# Altium project 小四轴.PrjPCB
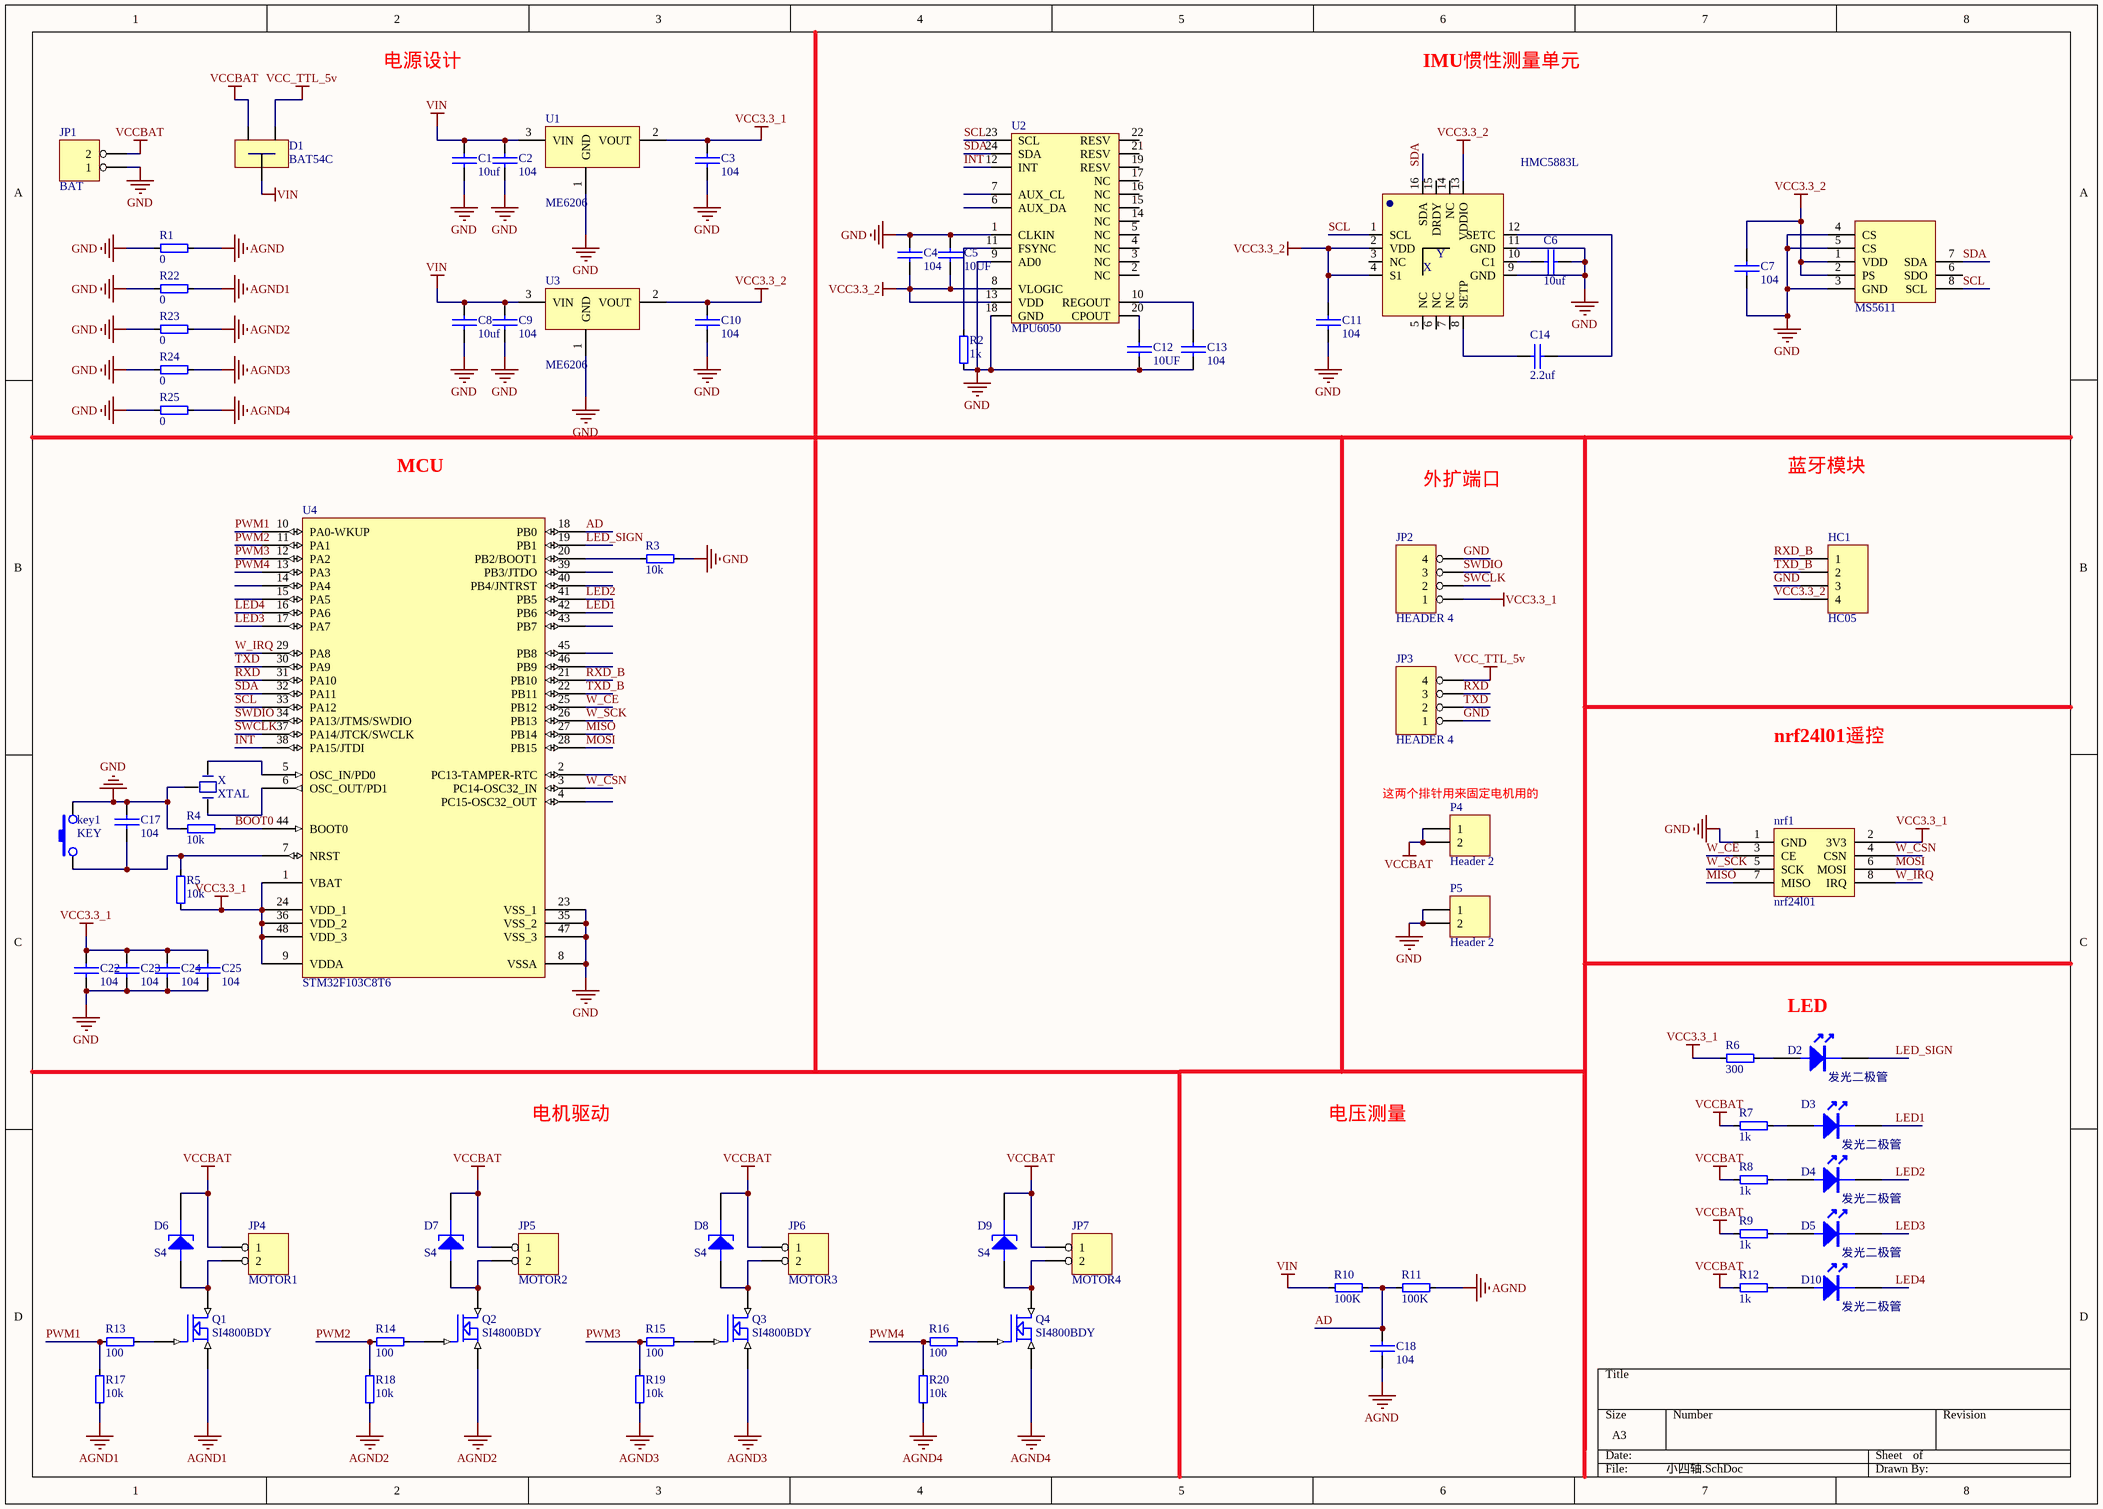
[diagram p0: 小四轴.SchDoc]
1 sheet, 77 parts. Net scope: global (net labels, ports and power ports of the same name join across sheets).
Board file: 小四轴.PcbDoc

## Sheet 小四轴.SchDoc
size A3

### Parts
*1  HMC5883L  [hmc5883l]
arctory1  MS5611  [MS5611]
C1  10uf  [0603P]
C2  104  [0603P]
C3  104  [0603P]
C4  104  [0603P]
C5  10UF  [0603P]
C6  10uf  [0603P]
C7  104  [0603p]
C8  10uf  [0603P]
C9  104  [0603P]
C10  104  [0603P]
C11  104  [0603P]
C12  10UF  [0603P]
C13  104  [0603P]
C14  2.2uf  [0603P]
C17  104  [0603P]
C18  104  [0603P]
C22  104  [0603P]
C23  104  [0603P]
C24  104  [0603P]
C25  104  [0603P]
D1  BAT54C  [SOT23]
D2  发光二极管  [0805]
D3  发光二极管  [0805]
D4  发光二极管  [0805]
D5  发光二极管  [0805]
D6  S4  [LC-SOD-123]
D7  S4  [LC-SOD-123]
D8  S4  [LC-SOD-123]
D9  S4  [LC-SOD-123]
D10  发光二极管  [0805]
HC1  HC05  [HDR1X4]
JP1  BAT  [HDR1X2]
JP2  HEADER 4  [HDR1X4]
JP3  HEADER 4  [HDR1X4]
JP4  MOTOR1  [HDR1X2]
JP5  MOTOR2  [HDR1X2]
JP6  MOTOR3  [HDR1X2]
JP7  MOTOR4  [HDR1X2]
key1  KEY  [贴片按键6.1x3.7]
nrf1  nrf24l01  [HDR2X4]
P4  Header 2  [HDR1X2]
P5  Header 2  [HDR1X2]
Q1  SI4800BDY  [LC-SOIC-8_150mil]
Q2  SI4800BDY  [LC-SOIC-8_150mil]
Q3  SI4800BDY  [LC-SOIC-8_150mil]
Q4  SI4800BDY  [LC-SOIC-8_150mil]
R1  0  [0603P]
R2  1k  [0603P]
R3  10k  [0603P]
R4  10k  [0603P]
R5  10k  [0603P]
R6  300  [0603P]
R7  1k  [0603P]
R8  1k  [0603P]
R9  1k  [0603P]
R10  100K  [0603P]
R11  100K  [0603P]
R12  1k  [0603P]
R13  100  [0603P]
R14  100  [0603P]
R15  100  [0603P]
R16  100  [0603P]
R17  10k  [0603P]
R18  10k  [0603P]
R19  10k  [0603P]
R20  10k  [0603P]
R22  0  [0603P]
R23  0  [0603P]
R24  0  [0603P]
R25  0  [0603P]
U1  ME6206  [ME6206]
U2  MPU6050  [QFN24]
U3  ME6206  [ME6206]
U4  STM32F103C8T6  [LQFP48_N]
X  XTAL  [三脚晶振]

### Nets
AGND: C18.1 R1.1 R11.1
AGND1: Q1.3(S) R17.2 R22.1
AGND2: Q2.3(S) R18.2 R23.1
AGND3: Q3.3(S) R19.2 R24.1
AGND4: Q4.3(S) R20.2 R25.1
GND: *1.9(GND) *1.11(GND) arctory1.3(GND) arctory1.4(CS) arctory1.5(CS) C1.1 C2.1 C3.1 C4.1 C5.2 C6.2 C7.2 C8.1 C9.1 C10.1 C11.2 C12.1 C13.2 C17.1 C22.1 C23.1 C24.1 C25.1 HC1.3 JP1.1 JP2.4 JP3.1 key1.2 nrf1.1(GND) P5.1 P5.2 R1.2 R2.1 R3.1 R4.1 R22.2 R23.2 R24.2 R25.2 U1.1(GND) U2.1(CLKIN) U2.9(AD0) U2.18(GND) U3.1(GND) U4.8(VSSA) U4.23(VSS_1) U4.35(VSS_2) U4.47(VSS_3) X.3
VCC3.3_1: C3.2 C22.2 C23.2 C24.2 C25.2 JP2.1 nrf1.2(3V3) R5.2 R6.2 U1.2(VOUT) U4.1(VBAT) U4.9(VDDA) U4.24(VDD_1) U4.36(VDD_2) U4.48(VDD_3)
VCC3.3_2: *1.2(VDD) *1.4(S1) *1.13(VDDIO) arctory1.1(VDD) arctory1.2(PS) C4.2 C5.1 C7.1 C10.2 C11.1 HC1.4 U2.8(VLOGIC) U2.13(VDD) U3.2(VOUT)
VCC_TTL_5v: D1.B JP3.4
VCCBAT: D1.E D6.2(K) D7.2(K) D8.2(K) D9.2(K) JP1.2 JP4.1 JP5.1 JP6.1 JP7.1 P4.1 P4.2 R7.2 R8.2 R9.2 R12.2
VIN: C1.2 C2.2 C8.2 C9.2 D1.C R10.2 U1.3(VIN) U3.3(VIN)
AD: C18.2 R10.1 R11.2 U4.18(PB0)
BOOT0: R4.2 U4.44(BOOT0)
INT: U2.12(INT) U4.38(PA15/JTDI)
LED1: D3.2 U4.42(PB6)
LED2: D4.2 U4.41(PB5)
LED3: D5.2 U4.17(PA7)
LED4: D10.2 U4.16(PA6)
LED_SIGN: D2.2 U4.19(PB1)
MISO: nrf1.7(MISO) U4.27(PB14)
MOSI: nrf1.6(MOSI) U4.28(PB15)
PWM1: R13.2 R17.1 U4.10(PA0-WKUP)
PWM2: R14.2 R18.1 U4.11(PA1)
PWM3: R15.2 R19.1 U4.12(PA2)
PWM4: R16.2 R20.1 U4.13(PA3)
RXD: JP3.3 U4.31(PA10)
RXD_B: HC1.1 U4.21(PB10)
SCL: *1.1(SCL) arctory1.8(SCL) U2.23(SCL) U4.33(PA12)
SDA: *1.16(SDA) arctory1.7(SDA) U2.24(SDA) U4.32(PA11)
SWCLK: JP2.2 U4.37(PA14/JTCK/SWCLK)
SWDIO: JP2.3 U4.34(PA13/JTMS/SWDIO)
TXD: JP3.2 U4.30(PA9)
TXD_B: HC1.2 U4.22(PB11)
W_CE: nrf1.3(CE) U4.25(PB12)
W_CSN: nrf1.4(CSN) U4.3(PC14-OSC32_IN)
W_IRQ: nrf1.8(IRQ) U4.29(PA8)
W_SCK: nrf1.5(SCK) U4.26(PB13)
Net*1_8: *1.8(SETP) C14.1
Net*1_10: *1.10(C1) C6.1
Net*1_12: *1.12(SETC) C14.2
NetC12_2: C12.2 U2.20(CPOUT)
NetC13_1: C13.1 U2.10(REGOUT)
NetC17_2: C17.2 key1.1 R5.1 U4.7(NRST)
NetD2_1: D2.1 R6.1
NetD3_1: D3.1 R7.1
NetD4_1: D4.1 R8.1
NetD5_1: D5.1 R9.1
NetD6_1: D6.1(A) JP4.2 Q1.2(D)
NetD7_1: D7.1(A) JP5.2 Q2.2(D)
NetD8_1: D8.1(A) JP6.2 Q3.2(D)
NetD9_1: D9.1(A) JP7.2 Q4.2(D)
NetD10_1: D10.1 R12.1
NetQ1_1: Q1.1(G) R13.1
NetQ2_1: Q2.1(G) R14.1
NetQ3_1: Q3.1(G) R15.1
NetQ4_1: Q4.1(G) R16.1
NetR2_2: R2.2 U2.11(FSYNC)
NetR3_2: R3.2 U4.20(PB2/BOOT1)
NetU4_5: U4.5(OSC_IN/PD0) X.1
NetU4_6: U4.6(OSC_OUT/PD1) X.2

Not connected (* = marked no-connect by the designer): *1 3(NC) 5(NC) 6(NC) 7(NC) 14(NC) 15(DRDY); arctory1 6(SDO); U2 2(NC) 3(NC) 4(NC) 5(NC) 6(AUX_DA) 7(AUX_CL) 14(NC) 15(NC) 16(NC) 17(NC) 19(RESV) 21(RESV) 22(RESV); U4 2(PC13-TAMPER-RTC) 4(PC15-OSC32_OUT) 14(PA4) 15(PA5) 39(PB3/JTDO) 40(PB4/JNTRST) 43(PB7) 45(PB8) 46(PB9)

### Notes on the sheet
- 电源设计
- IMU惯性测量单元
- MCU
- 外扩端口
- 蓝牙模块
- nrf24l01遥控
- (near P4) 这两个排针用来固定电机用的
- LED
- 电机驱动
- 电压测量
- (in symbol HMC5883L) .; Y; X

### Library data of the parts
C1 C6 C8 = C_N: Capacitor; value: 22uf
C2-C4 C7 C9-C11 C13 C14 C17 C18 C22-C25 = C_N: Capacitor
  C2-C4 C7 C9-C11 C13 C17 C18 C22-C25: value: 104
  C14: value: 2.2uf
C5 C12 = C_N: Capacitor; value: 104
D6-D9 = TUNNEL: Tunnel FDiode
HC1 = Header 4: Header, 4-Pin; LatestRevisionDate: 17-Jul-2002; LatestRevisionNote: Re-released for DXP Platform.; Publisher: Altium Limited
JP1 JP4-JP7 = HEADER 2
JP2 JP3 = HEADER 4: 4 Pin Header
nrf1 = nrf24l01: pin to pad: 1>8 2>7 3>6 4>5 5>4 6>3 7>2 8>1
P4 P5 = Header 2: Header, 2-Pin; LatestRevisionDate: 17-Jul-2002; LatestRevisionNote: Re-released for DXP Platform.; Publisher: Altium Limited
Q1-Q4 = MOSFET N: pin to pad: 1>5+6+7+8 2>4 3>1+2+3
R1 R3-R6 R10 R11 R13-R20 R22-R25 = RES: value: 1k
R2 R7-R9 R12 = RES: value: 1k
U2 = MPU6050: 9轴运动处理传感器
U4 = STM32F103C8T6: STM32 ARM-based 32-bit MCU with 64 Kbytes Flash, 48-pin LQFP, Industrial Temperature; Published: *; DatasheetVersion: *; PackageVersion: *; PackageReference: *; Publisher: *; PackageDescription: *; ComponentLink1Description: *; ComponentLink1URL: *; ComponentLink2Description: *; ComponentLink2URL: *
X = XTAL_3P